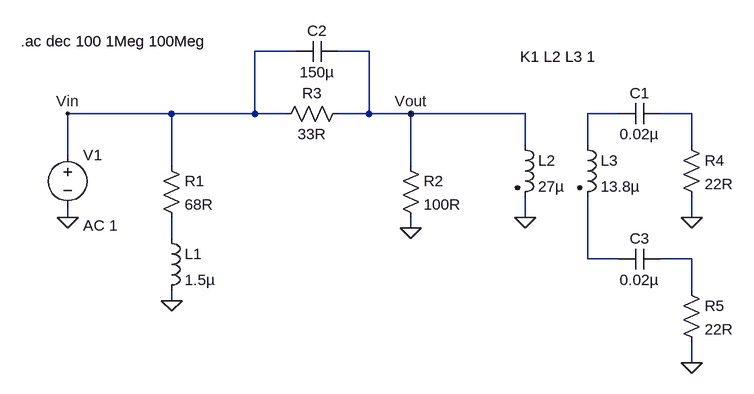
[diagram p0: schematic Amp front end testing.asc]
Amp front end testing.asc, the LTspice schematic file:
Version 4
SHEET 1 900 680
WIRE 224 16 160 16
WIRE 336 16 288 16
WIRE 32 112 -128 112
WIRE 160 112 160 16
WIRE 160 112 32 112
WIRE 208 112 160 112
WIRE 336 112 336 16
WIRE 336 112 288 112
WIRE 400 112 336 112
WIRE 576 112 400 112
WIRE 720 112 672 112
WIRE 832 112 784 112
WIRE 576 160 576 112
WIRE 672 160 672 112
WIRE 832 160 832 112
WIRE -128 176 -128 112
WIRE 32 192 32 112
WIRE 400 192 400 112
WIRE -128 272 -128 256
WIRE 576 272 576 240
WIRE 832 272 832 240
WIRE 400 288 400 272
WIRE 32 304 32 272
WIRE 672 336 672 240
WIRE 720 336 672 336
WIRE 832 336 784 336
WIRE 832 384 832 336
WIRE 32 400 32 384
WIRE 832 496 832 464
FLAG 400 288 0
FLAG 32 400 0
FLAG -128 272 0
FLAG 400 112 Vout
FLAG -128 112 Vin
FLAG 576 272 0
FLAG 832 272 0
FLAG 832 496 0
SYMBOL voltage -128 160 R0
WINDOW 123 24 124 Left 2
WINDOW 39 0 0 Left 0
SYMATTR InstName V1
SYMATTR Value ""
SYMATTR Value2 AC 1
SYMBOL res 16 176 R0
SYMATTR InstName R1
SYMATTR Value 68R
SYMBOL ind 16 288 R0
SYMATTR InstName L1
SYMATTR Value 1.5µ
SYMBOL res 384 176 R0
SYMATTR InstName R2
SYMATTR Value 100R
SYMBOL cap 288 0 R90
WINDOW 0 0 32 VBottom 2
WINDOW 3 32 32 VTop 2
SYMATTR InstName C2
SYMATTR Value 150µ
SYMBOL res 304 96 R90
WINDOW 0 0 56 VBottom 2
WINDOW 3 32 56 VTop 2
SYMATTR InstName R3
SYMATTR Value 33R
SYMBOL ind2 560 144 R0
SYMATTR InstName L2
SYMATTR Value 27µ
SYMATTR Type ind
SYMBOL ind2 656 144 R0
SYMATTR InstName L3
SYMATTR Value 13.8µ
SYMATTR Type ind
SYMBOL res 816 144 R0
SYMATTR InstName R4
SYMATTR Value 22R
SYMBOL cap 784 96 R90
WINDOW 0 0 32 VBottom 2
WINDOW 3 32 32 VTop 2
SYMATTR InstName C1
SYMATTR Value 0.02µ
SYMBOL res 816 368 R0
SYMATTR InstName R5
SYMATTR Value 22R
SYMBOL cap 784 320 R90
WINDOW 0 0 32 VBottom 2
WINDOW 3 32 32 VTop 2
SYMATTR InstName C3
SYMATTR Value 0.02µ
TEXT -200 0 Left 2 !.ac dec 100 1Meg 100Meg
TEXT 568 24 Left 2 !K1 L2 L3 1

The netlist it stands for:
* Amp front end testing.asc
V1 Vin 0 AC 1
R1 Vin N003 68R
L1 N003 0 1.5µ
R2 Vout 0 100R
C2 Vout Vin 150µ
R3 Vout Vin 33R
L2 Vout 0 27µ
L3 N001 N004 13.8µ
R4 N002 0 22R
C1 N002 N001 0.02µ
R5 N005 0 22R
C3 N005 N004 0.02µ
.ac dec 100 1Meg 100Meg
K1 L2 L3 1
.backanno
.end